# EasyEDA Pro project PT32S038x-Demo.eprj, board DEMOPT32x038x Development Kit 1.0
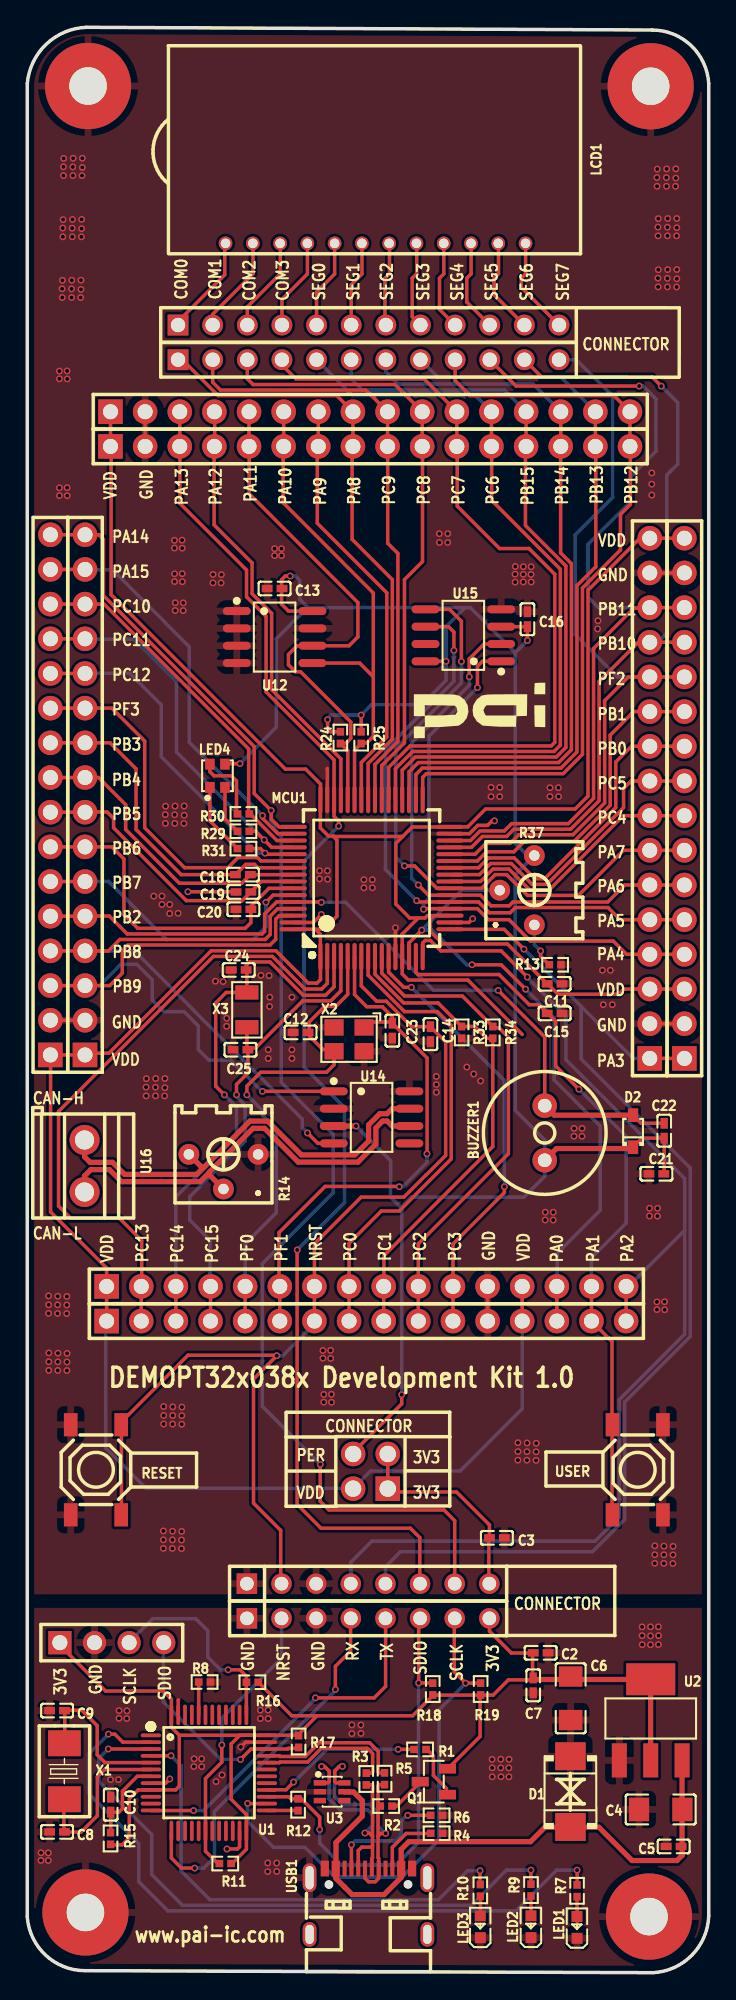
[diagram p3: board, top side]
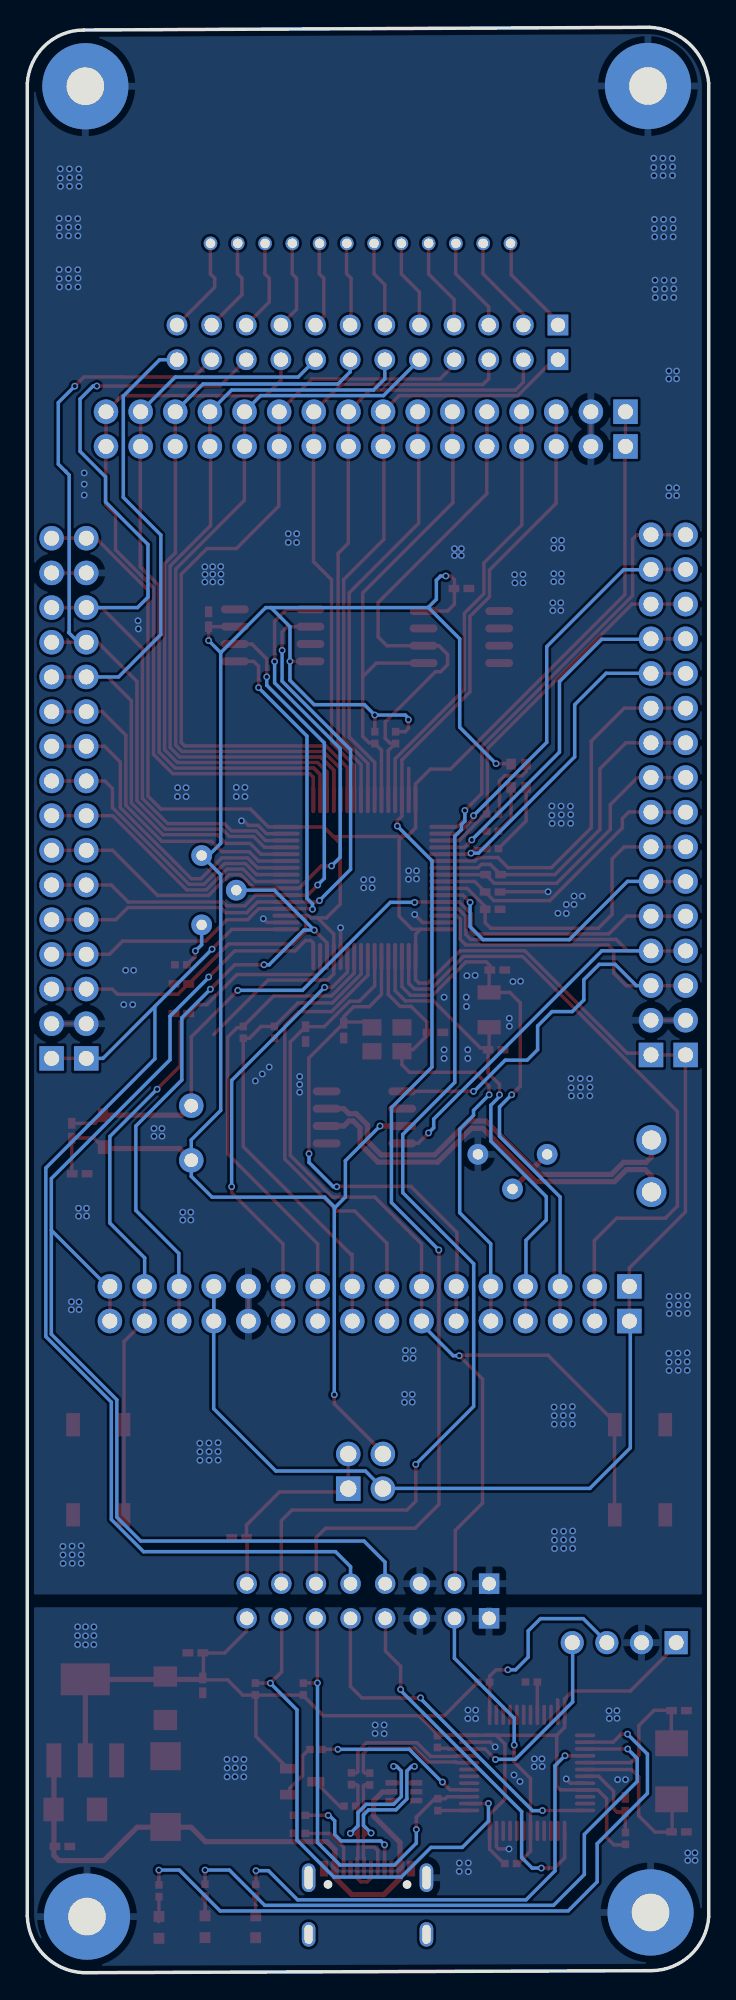
[diagram p4: board, bottom side, seen from below]

Outline 49.98 x 142.49 mm; copper layers: Top Layer, Bottom Layer. Coordinates in mm from the lower left corner of the outline.
Outline path: 0,138.38 0,4.09 arc(1.34,1.29) 4.23,0.15 45.89,0 arc(48.74,1.28) 49.98,4.16 49.98,138.36 arc(48.69,141.15) 45.83,142.29 4.36,142.49 arc(1.4,141.26) 0,138.38
Stack: Top Layer 0.035mm / Dielectric1 1.51mm FR4 er 4.5 / Bottom Layer 0.035mm

## Design rules (mm)
net D-: USB1
net D+: USB1
net USB_DM: USB2
net USB_DP: USB2
net CAN_H: CAN
net CAN_L: CAN
spacing safeClearance (default): track to track 0.152, other pairs 0.152 to 0.3
track width trackWidth (default): min 0.127, default 0.254, max 2.54
differential pair differentialPair (default): width min 0.127, default 0.254, max 2.54; gap min 0.152, default 0.152
via viaSize (default): diameter min 0.5, default 0.61, max 10; hole min 0.3, default 0.305, max 6

## Placement (name value [footprint] x y rotation side)
BUZZER1  2700Hz  [BUZ-TH_BD9.0-P4.00-D0.6-FD]  37.95 61.51 90 top
C2  100nF  [C0402]  37.65 23.43 180 top
C3  100nF  [C0402]  34.44 31.85 180 top
C4  10uF  [C1206]  46.46 11.96 0 top
C5  100nF  [C0402]  47.41 9.25 0 top
C6  10uF  [C1206]  39.85 20.1 90 top
C7  100nF  [C0402]  37.11 21.05 90 top
C8  20pF  [C0402]  2.18 10.31 0 top
C9  20pF  [C0402]  2.18 19.2 0 top
C10  100nF  [C0402]  6.12 12.31 270 top
C11  100nF  [C0402]  38.68 72.43 180 top
C12  12pF  [C0402]  20.04 68.87 180 top
C13  100nF  [C0402]  18.14 101.38 180 top
C14  100nF  [C0402]  29.57 68.74 90 top
C15  100nF  [C0402]  38.68 70.26 180 top
C16  10uF  [C0402]  36.68 99.13 90 top
C18  100nF  [C0402]  15.82 80.43 180 top
C19  100nF  [C0402]  15.85 79.16 180 top
C20  100nF  [C0402]  15.85 77.89 180 top
C21  100nF  [C0402]  46.14 58.52 0 top
C22  100nF  [C0402]  46.71 61.67 270 top
C23  12pF  [C0402]  26.77 69 90 top
C24  12pF  [C0402]  15.51 73.44 180 top
C25  12pF  [C0402]  15.64 67.6 180 top
CN4  RE-H042TD-1190(LF)(SN)  [HDR-TH_4P-P2.54-V_RE-H042TD-1190]  6.2 24.17 0 top
D1  P6SMB6.8CA/TR13  [SMB_L4.6-W3.6-LS5.3-BI]  39.83 13.26 270 top
D2  1N4148WS  [SOD-323_L1.8-W1.3-LS2.5-RD]  44.43 61.63 90 top
H1  KH-2.54PH180-1X12P-L11.5  [HDR-TH_12P-P2.54-V-M]  25.03 118.14 0 top
H2  KH-2.54PH180-1X16P-L11.5  [HDR-TH_16P-P2.54-V-M]  48.19 86.02 90 top
H3  A2541WV-2x2P  [HDR-TH_4P-P2.54-V-R2-C2-S2.54_A2541WV-2X2P]  25.17 36.72 90 top
H4  KH-2.54PH180-1X12P-L11.5  [HDR-TH_12P-P2.54-V-M]  25.03 120.68 0 top
H5  KH-2.54PH180-1X16P-L11.5  [HDR-TH_16P-P2.54-V-M]  45.65 86.02 90 top
H6  KH-2.54PH180-1X16P-L11.5  [HDR-TH_16P-P2.54-V-M]  25.15 111.79 0 top
H7  KH-2.54PH180-1X16P-L11.5  [HDR-TH_16P-P2.54-V-M]  25.15 114.33 0 top
H8  KH-2.54PH180-1X8P-L11.5  [HDR-TH_8P-P2.54-V-M]  25 25.95 0 top
H9  KH-2.54PH180-1X8P-L11.5  [HDR-TH_8P-P2.54-V-M]  25 28.49 0 top
H10  KH-2.54PH180-1X16P-L11.5  [HDR-TH_16P-P2.54-V-M]  24.87 47.73 0 top
H11  KH-2.54PH180-1X16P-L11.5  [HDR-TH_16P-P2.54-V-M]  24.87 50.27 0 top
H12  KH-2.54PH180-1X16P-L11.5  [HDR-TH_16P-P2.54-V-M]  4.24 86.27 90 top
H13  KH-2.54PH180-1X16P-L11.5  [HDR-TH_16P-P2.54-V-M]  1.7 86.27 90 top
LCD1  -  [LCD_12pin_4com_8seg]  25.34 133.39 0 top
LED1  19-217/GHC-YR1S2/3T  [LED0603-RD]  40.32 3.32 90 top
LED2  19-213/Y2C-CQ2R2L/3T(CY)  [LED0603-RD]  36.94 3.37 90 top
LED3  19-217/BHC-ZL1M2RY/3T  [LED0603-RD]  33.23 3.36 90 top
LED4  FM-B2020RGBA-HG  [LED-SMD_FM-B2020RGBA-HG]  13.95 87.67 90 top
MCU1  -  [LQFP-64_L10.0-W10.0-P0.50-LS12.0-BL]  25.25 80.17 0 top
NOREF  -  [DEMO板安装孔]  4.27 4.41 180 top
NOREF#2  -  [DEMO板安装孔]  45.6 4.11 180 top
NOREF#3  -  [DEMO板安装孔]  45.72 138.17 180 top
NOREF#4  -  [DEMO板安装孔]  4.46 138.19 180 top
Q1  SS8550 Y2  [SOT-23-3_L2.9-W1.3-P1.90-LS2.4-BR]  29.82 13.99 0 top
R1  1.5kΩ  [R0402]  28.81 16.35 180 top
R2  1.5kΩ  [R0402]  26.32 12.2 0 top
R3  22Ω  [R0402]  24.86 14.19 90 top
R4  5.1kΩ  [R0402]  30.02 10.21 0 top
R5  22Ω  [R0402]  26.2 14.21 90 top
R6  5.1kΩ  [R0402]  30.02 11.53 180 top
R7  1kΩ  [R0402]  40.32 6 90 top
R8  10kΩ  [R0402]  13 21.29 0 top
R9  1kΩ  [R0402]  36.94 6.05 90 top
R10  1kΩ  [R0402]  33.23 6.03 90 top
R11  10kΩ  [R0402]  14.52 8 180 top
R12  100Ω  [R0402]  19.86 12.3 90 top
R13  10kΩ  [R0402]  38.71 73.82 180 top
R14  1kΩ  [RES-ADJ-TH_3362P]  14.39 58.67 180 top
R15  10kΩ  [R0402]  6.11 9.83 270 top
R16  10kΩ  [R0402]  16.51 21.27 180 top
R17  10kΩ  [R0402]  19.9 16.93 270 top
R18  10kΩ  [R0402]  29.74 20.78 90 top
R19  10kΩ  [R0402]  33.25 20.78 90 top
R24  10kΩ  [R0402]  22.96 90.46 90 top
R25  10kΩ  [R0402]  24.49 90.46 90 top
R29  1kΩ  [R0402]  15.85 83.6 180 top
R30  1kΩ  [R0402]  15.85 84.87 180 top
R31  1kΩ  [R0402]  15.85 82.33 180 top
R33  100kΩ  [R0402]  31.85 68.87 90 top
R34  100kΩ  [R0402]  34.14 68.87 90 top
R37  10kΩ  [RES-ADJ-TH_3362P]  35.92 79.29 90 top
RESET  TS-1187A-B-A-B  [SW-SMD_4P-L5.1-W5.1-P3.70-LS6.5-TL-2]  5.04 36.84 270 top
U1  STM32F103CBT6  [LQFP-48_L7.0-W7.0-P0.50-LS9.0-BL]  13.32 14.63 270 top
U2  AMS1117-3.3  [SOT-223-3_L6.5-W3.4-P2.30-LS7.0-BR]  45.72 18.52 270 top
U3  NUP4202W1T2G  [SOT-363_L2.0-W1.3-P0.65-LS2.1-BR]  22.36 13.26 180 top
U12  K24C02  [SOIC-8_L4.9-W3.9-P1.27-LS6.0-BL]  18.14 97.83 270 top
U14  SN65HVD230DR  [SOIC-8_L4.9-W3.9-P1.27-LS6.0-BL]  25.25 62.65 270 top
U15  ZD25WD40BTIGT  [SOIC-8_L4.9-W3.9-P1.27-LS6.0-BL]  31.98 97.95 90 top
U16  KF128L-3.81-2P  [CONN-TH_P3.81_KF128L-3.81-2P]  4.2 59.09 270 top
USB1  TYPEC-304-ACP16  [USB-C-SMD_TYPE-C-16P-1]  25.02 5.22 0 top
USER  TS-1187A-B-A-B  [SW-SMD_4P-L5.1-W5.1-P3.70-LS6.5-TL-2]  44.77 36.84 90 top
X1  8MHz  [CRYSTAL-SMD_L5.0-W3.2]  2.73 14.75 270 top
X2  25MHz  [OSC-SMD_4P-L3.2-W2.5-BL]  23.6 68.36 180 top
X3  32KHz  [OSC-SMD_L3.2-W1.5]  16.11 70.52 270 top

## Footprints (pads in the part's own frame, mm; a bottom-side part is the same pattern mirrored in y, then rotated)
BUZ-TH_BD9.0-P4.00-D0.6-FD
  round 1.8 hole 1: 1(-2,0) 2(2,0)
C0402
  rect 0.79x0.54 smd: 1(-0.545,0) 2(0.545,0)
C1206
  rect 1.485x1.728 smd: 1(-1.593,0) 2(1.593,0)
CONN-TH_P3.81_KF128L-3.81-2P
  round 2.2 hole 1.4: 1(-1.905,0) 2(1.905,0)
CRYSTAL-SMD_L5.0-W3.2
  rect 1.9x2.4 smd: 1(-2.05,0) 2(2.05,0)
DEMO板安装孔
  round 6.32 hole 2.75: 1(0,0)
HDR-TH_4P-P2.54-V-R2-C2-S2.54_A2541WV-2X2P
  rect 1.8x1.8 hole 1.2: 1(-1.27,-1.27)
  round 1.8 hole 1.2: 2(-1.27,1.27) 3(1.27,-1.27) 4(1.27,1.27)
HDR-TH_4P-P2.54-V_RE-H042TD-1190
  rect 1.7x1.7 hole 1.1: 1(-3.81,0)
  round 1.7 hole 1.1: 2(-1.27,0) 3(1.27,0) 4(3.81,0)
HDR-TH_8P-P2.54-V-M
  rect 1.5x1.5 hole 1: 1(-8.89,0)
  round 1.5 hole 1: 2(-6.35,0) 3(-3.81,0) 4(-1.27,0) 5(1.27,0) 6(3.81,0) 7(6.35,0) 8(8.89,0)
HDR-TH_12P-P2.54-V-M
  rect 1.524x1.524 hole 1.05: 1(-13.97,0)
  round 1.524 hole 1.05: 2(-11.43,0) 3(-8.89,0) 4(-6.35,0) 5(-3.81,0) 6(-1.27,0) 7(1.27,0) 8(3.81,0) 9(6.35,0) 10(8.89,0) 11(11.43,0) 12(13.97,0)
HDR-TH_16P-P2.54-V-M
  rect 1.8x1.8 hole 1.1: 1(-19.05,0)
  round 1.8 hole 1.1: 2(-16.51,0) 3(-13.97,0) 4(-11.43,0) 5(-8.89,0) 6(-6.35,0) 7(-3.81,0) 8(-1.27,0) 9(1.27,0) 10(3.81,0) 11(6.35,0) 12(8.89,0) 13(11.43,0) 14(13.97,0) 15(16.51,0) 16(19.05,0)
LCD_12pin_4com_8seg
  round 1 hole 0.7: 1(-10.795,-6.731) 2(-8.795,-6.731) 3(-6.795,-6.731) 4(-4.795,-6.731) 5(-2.795,-6.731) 6(-0.795,-6.731) 7(1.205,-6.731) 8(3.205,-6.731) 9(5.205,-6.731) 10(7.205,-6.731) 11(9.205,-6.731) 12(11.205,-6.731)
LED0603-RD
  rect 0.8x0.8 smd: 1(-0.799,-0.004) 2(0.799,0.004)
LED-SMD_FM-B2020RGBA-HG
  rect 0.8x0.701 smd: 1(-0.851,0.551) 2(0.851,0.551) 3(0.851,-0.551) 4(-0.851,-0.551)
LQFP-48_L7.0-W7.0-P0.50-LS9.0-BL
  oval 0.27x1.5 smd: 1(-2.75,-4.25) 2(-2.25,-4.25) 3(-1.75,-4.25) 4(-1.25,-4.25) 5(-0.75,-4.25) 6(-0.25,-4.25) 7(0.25,-4.25) 8(0.75,-4.25) 9(1.25,-4.25) 10(1.75,-4.25) 11(2.25,-4.25) 12(2.75,-4.25) 25(2.75,4.25) 26(2.25,4.25) 27(1.75,4.25) 28(1.25,4.25) 29(0.75,4.25) 30(0.25,4.25) 31(-0.25,4.25) 32(-0.75,4.25) 33(-1.25,4.25) 34(-1.75,4.25) 35(-2.25,4.25) 36(-2.75,4.25)
  oval 1.5x0.27 smd: 13(4.25,-2.75) 14(4.25,-2.25) 15(4.25,-1.75) 16(4.25,-1.25) 17(4.25,-0.75) 18(4.25,-0.25) 19(4.25,0.25) 20(4.25,0.75) 21(4.25,1.25) 22(4.25,1.75) 23(4.25,2.25) 24(4.25,2.75) 37(-4.25,2.75) 38(-4.25,2.25) 39(-4.25,1.75) 40(-4.25,1.25) 41(-4.25,0.75) 42(-4.25,0.25) 43(-4.25,-0.25) 44(-4.25,-0.75) 45(-4.25,-1.25) 46(-4.25,-1.75) 47(-4.25,-2.25) 48(-4.25,-2.75)
LQFP-64_L10.0-W10.0-P0.50-LS12.0-BL
  oval 0.3x2 smd: 1(-3.75,-5.75) 2(-3.25,-5.75) 3(-2.75,-5.75) 4(-2.25,-5.75) 5(-1.75,-5.75) 6(-1.25,-5.75) 7(-0.75,-5.75) 8(-0.25,-5.75) 9(0.25,-5.75) 10(0.75,-5.75) 11(1.25,-5.75) 12(1.75,-5.75) 13(2.25,-5.75) 14(2.75,-5.75) 15(3.25,-5.75) 16(3.75,-5.75) 33(3.75,5.75) 34(3.25,5.75) 35(2.75,5.75) 36(2.25,5.75) 37(1.75,5.75) 38(1.25,5.75) 39(0.75,5.75) 40(0.25,5.75) 41(-0.25,5.75) 42(-0.75,5.75) 43(-1.25,5.75) 44(-1.75,5.75) 45(-2.25,5.75) 46(-2.75,5.75) 47(-3.25,5.75) 48(-3.75,5.75)
  oval 2x0.3 smd: 17(5.75,-3.75) 18(5.75,-3.25) 19(5.75,-2.75) 20(5.75,-2.25) 21(5.75,-1.75) 22(5.75,-1.25) 23(5.75,-0.75) 24(5.75,-0.25) 25(5.75,0.25) 26(5.75,0.75) 27(5.75,1.25) 28(5.75,1.75) 29(5.75,2.25) 30(5.75,2.75) 31(5.75,3.25) 32(5.75,3.75) 49(-5.75,3.75) 50(-5.75,3.25) 51(-5.75,2.75) 52(-5.75,2.25) 53(-5.75,1.75) 54(-5.75,1.25) 55(-5.75,0.75) 56(-5.75,0.25) 57(-5.75,-0.25) 58(-5.75,-0.75) 59(-5.75,-1.25) 60(-5.75,-1.75) 61(-5.75,-2.25) 62(-5.75,-2.75) 63(-5.75,-3.25) 64(-5.75,-3.75)
OSC-SMD_4P-L3.2-W2.5-BL
  rect 1.4x1.2 smd: 1(-1.1,-0.875) 2(1.1,-0.875) 3(1.1,0.875) 4(-1.1,0.875)
OSC-SMD_L3.2-W1.5
  rect 1.05x1.7 smd: 1(-1.275,0) 2(1.275,0)
R0402
  rect 0.566x0.54 smd: 1(-0.433,0) 2(0.433,0)
RES-ADJ-TH_3362P
  round 1.524 hole 0.762: 1(-2.54,-1.27) 2(0,1.27) 3(2.54,-1.27)
SMB_L4.6-W3.6-LS5.3-BI
  rect 2.047x2.241 smd: 1(-2.591,0) 2(2.591,0)
SOD-323_L1.8-W1.3-LS2.5-RD
  rect 1x0.75 smd: 1(-1.173,0) 2(1.173,0)
SOIC-8_L4.9-W3.9-P1.27-LS6.0-BL
  oval 0.588x2.045 smd: 1(-1.905,-2.772) 2(-0.635,-2.772) 3(0.635,-2.772) 4(1.905,-2.772) 5(1.905,2.772) 6(0.635,2.772) 7(-0.635,2.772) 8(-1.905,2.772)
SOT-23-3_L2.9-W1.3-P1.90-LS2.4-BR
  rect 1.25x0.7 smd: 1(1,-0.95) 2(1,0.95) 3(-1,0)
SOT-223-3_L6.5-W3.4-P2.30-LS7.0-BR
  rect 2.5x1.1 smd: 1(2.97,-2.3) 2(2.97,0) 3(2.97,2.3)
  rect 2.34x3.6 smd: 4(-2.97,0)
SOT-363_L2.0-W1.3-P0.65-LS2.1-BR
  rect 0.9x0.4 smd: 1(0.9,-0.65) 2(0.9,0) 3(0.9,0.65) 4(-0.9,0.65) 5(-0.9,0) 6(-0.9,-0.65)
SW-SMD_4P-L5.1-W5.1-P3.70-LS6.5-TL-2
  rect 1.7x1 smd: 1(-3.3,1.85) 2(3.3,1.85) 3(-3.3,-1.85) 4(3.3,-1.85)
USB-C-SMD_TYPE-C-16P-1
  rect 0.6x1.15 smd: A1B12(-3.2,2.41) A4B9(-2.4,2.41) B1A12(3.2,2.41) B4A9(2.4,2.41)
  rect 0.3x1.15 smd: A5(-1.25,2.41) A6(-0.25,2.41) A7(0.25,2.41) A8(1.25,2.41) B5(1.75,2.41) B6(0.75,2.41) B7(-0.75,2.41) B8(-1.75,2.41)
  oval 1x2.1 hole 0.6x1.7: EP(-4.32,1.74) EP(4.32,1.74)
  oval 1x1.8 hole 0.6x1.4: EP(-4.32,-2.41) EP(4.32,-2.41)

## Nets
As in the schematic, except:
GND: C2.1 C3.1 C4.1 C5.1 C6.1 C7.1 C8.1 C9.1 C10.1 C11.1 C12.2 C13.2 C14.1 C15.1 C16.2 C19.2 C20.2 C21.1 C23.1 C24.2 C25.2 CN4.2 D1.1 H2.2 H2.15 H5.2 H5.15 H6.2 H7.2 H8.1 H8.3 H9.1 H9.3 H10.12 H11.12 H12.2 H13.2 LED1.1 LED2.1 LED3.1 MCU1.12 MCU1.18 MCU1.31 MCU1.47 MCU1.63 NOREF.1 NOREF#2.1 NOREF#3.1 NOREF#4.1 R4.2 R6.1 R8.2 R13.1 R14.1 R33.1 RESET.3 RESET.4 U1.8 U1.23 U1.35 U1.47 U2.1 U3.2 U12.1 U12.2 U12.3 U12.4 U12.7 U14.2 U14.8 U15.4 USB1.A1B12 USB1.B1A12 USB1.EP USER.3 USER.4 X2.2 X2.4
DEMO_NRST: C14.2 H9.2 H10.7 H11.7 MCU1.7 RESET.1 RESET.2
PA1/USER_KEY: C15.2 H10.15 H11.15 MCU1.15 USER.1 USER.2

Pads without a net: U1 1 10 11 14 15 16 17 19 20 21 22 29 30 31 38 39 40 41 42 43 45 46; U3 3 4; U14 5; U15 7; USB1 A8 B8

## Via types
v1: diameter 0.5, hole 0.3, Top Layer to Bottom Layer, 365 vias

## Routing (per net, layer and track width the routed paths; a pad name or vN(x,y) marks a point on that pad's centre or on a via; arc(x,y) is an arc through that point)
GND: length 35.2
  Top Layer w0.254: v1(21.57,77.51) 20.98,76.92 MCU1.63 ; H2.2 H5.2 ; v1(32.67,77.2) 32.4,76.92 MCU1.18 ; H6.2 H7.2 ; 11.07,18.87 11.07,19.96 11.1,19.98 ; H2.15 H5.15 ; U1.23 15.57,9.22 15.41,9.06 v1(14.65,9.06) ; v1(11.78,79.17) 15.29,79.17 C19.2 ; 22,85.92 22,88.2 22,88.2 ; 9.06,13.88 10.15,13.88 v1(10.45,14.19) ; 17.58,16.89 17.57,16.89 16.02,16.89 v1(15.66,16.53) ; H10.12 H11.12 ; MCU1.31 32.43,83.42 33.04,84.04 33.76,84.04 34.09,84.37 v1(34.27,84.37) ; H12.2 H13.2 ; v1(27,76.54) MCU1.12
  vias: v1(1.01,8.78) v1(1,8.22) v1(1.56,49.57) v1(1.57,48.92) v1(1.56,48.29) v1(1.54,8.77) v1(1.54,8.22) v1(1.58,45.4) v1(1.58,44.75) v1(1.58,44.12) v1(2.23,49.55) v1(2.23,48.92) v1(2.22,48.29) v1(2.25,45.38) v1(2.24,44.74) v1(2.24,44.11) v1(2.36,117.31) v1(2.36,116.74) v1(2.36,108.76) v1(2.36,108.19) v1(2.55,123.34) v1(2.56,122.7) v1(2.67,132.89) v1(2.65,132.27) v1(2.66,131.63) v1(2.62,128.4) v1(2.6,127.79) v1(2.61,127.14) v1(2.58,123.96) v1(2.92,117.32) v1(2.93,116.73) v1(2.92,108.77) v1(2.93,108.18) v1(2.9,49.53) v1(2.9,48.91) v1(2.89,48.28) v1(2.92,45.36) v1(2.91,44.73) v1(2.91,44.1) v1(3.27,123.97) v1(3.24,123.33) v1(3.25,122.7) v1(3.36,132.9) v1(3.34,132.26) v1(3.35,131.63) v1(3.31,128.41) v1(3.29,127.78) v1(3.3,127.14) v1(3.97,127.14) v1(3.94,123.97) v1(3.94,123.29) v1(3.92,122.69) v1(4.03,132.9) v1(4.03,132.22) v1(4.01,131.62) v1(3.99,128.42) v1(3.99,127.74) v1(6.11,14.14) v1(6.73,19.19) v1(6.73,18.63) v1(6.68,14.14) v1(7.31,19.18) v1(7.3,18.62) v1(8.73,65.48) v1(8.71,64.86) v1(8.72,64.22) v1(9.28,78.85) v1(9.42,65.49) v1(9.4,64.85) v1(9.41,64.22) v1(9.88,78.86) v1(9.88,78.24) v1(10,41.47) v1(10,40.82) v1(10,40.19) v1(9.98,32.35) v1(9.98,31.7) v1(9.98,31.08) v1(10.15,85.44) v1(10.12,84.82) v1(10.13,84.18) v1(10.09,65.49) v1(10.09,64.82) v1(10.07,64.22) v1(10.45,78.24) v1(10.44,77.58) v1(10.67,41.45) v1(10.66,40.81) v1(10.66,40.18) v1(10.65,32.34) v1(10.64,31.7) v1(10.64,31.07) v1(10.79,104.91) v1(10.79,104.35) v1(10.8,102.46) v1(10.8,101.89) v1(10.85,100.34) v1(10.85,99.77) v1(10.83,85.45) v1(10.81,84.81) v1(10.82,84.18) v1(11.06,77.6) v1(11.36,104.92) v1(11.36,104.34) v1(11.36,102.47) v1(11.37,101.88) v1(11.34,41.43) v1(11.34,40.8) v1(11.33,40.17) v1(11.32,32.32) v1(11.31,31.69) v1(11.31,31.06) v1(11.44,100.33) v1(11.43,99.77) v1(11.51,85.45) v1(11.51,84.78) v1(11.49,84.18) v1(12.23,15.66) v1(12.22,15.1) v1(12.79,15.66) v1(12.8,15.09) v1(13.62,102.42) v1(13.62,101.79) v1(13.8,72.62) v1(13.84,14) v1(14.24,102.4) v1(14.22,101.79) v1(14.36,72.59) v1(14.28,14.48) v1(14.63,69.91) v1(14.62,69.32) v1(17.13,73.05) v1(17.09,19.23) v1(17.1,18.61) v1(17.67,67.6) v1(17.67,66.96) v1(17.66,19.24) v1(17.67,18.61) v1(17.63,8.04) v1(17.63,7.4) v1(17.74,73.02) v1(17.77,70.77) v1(17.78,71.45) v1(18.14,104.3) v1(18.14,103.8) v1(18.29,8.03) v1(18.3,7.42) v1(18.65,104.3) v1(18.65,103.8) v1(19.41,71.45) v1(19.41,67.6) v1(19.41,66.97) v1(21.43,80.71) v1(21.43,80.11) v1(21.68,45.57) v1(21.68,45) v1(21.75,42.36) v1(21.75,41.79) v1(22.01,80.71) v1(22.03,80.09) v1(22.24,45.58) v1(22.25,44.99) v1(22.31,42.37) v1(22.32,41.78) v1(23.81,18.15) v1(23.81,17.51) v1(24.47,18.14) v1(24.47,17.53) v1(24.69,80.06) v1(24.69,79.46) v1(25.31,80.06) v1(25.31,79.46) v1(30,65.64) v1(30,65.05) v1(30,64.49) v1(30.22,105.4) v1(30.23,104.75) v1(30.84,105.4) v1(30.84,104.76) v1(32.24,66.33) v1(32.74,65.82) v1(33.25,65.32) v1(34.02,86.82) v1(34.01,86.14) v1(34.09,15.62) v1(34.1,15) v1(34.1,14.34) v1(34.65,86.81) v1(34.65,86.14) v1(34.72,15.64) v1(34.73,15) v1(34.74,14.35) v1(35.33,15.63) v1(35.32,15) v1(35.32,14.34) v1(35.77,102.44) v1(35.79,103) v1(35.78,101.85) v1(35.98,38.82) v1(35.99,38.17) v1(35.98,37.54) v1(36.38,102.98) v1(36.38,102.43) v1(36.37,101.86) v1(36.66,38.8) v1(36.65,38.16) v1(36.64,37.53) v1(36.95,102.97) v1(36.94,102.42) v1(36.95,101.86) v1(37.33,38.78) v1(37.32,38.15) v1(37.31,37.52) v1(37.99,55.7) v1(37.98,55.13) v1(38.34,86.79) v1(38.33,86.14) v1(38.57,55.13) v1(38.57,55.7) v1(38.95,86.79) v1(38.97,86.14) v1(40.1,61.84) v1(40.1,61.27) v1(40.69,61.84) v1(40.68,61.26) v1(41.86,99.02) v1(41.83,98.42) v1(42.18,73.42) v1(42.24,70.9) v1(42.76,73.42) v1(42.9,70.9) v1(45.09,25.33) v1(45.09,24.69) v1(45.09,24.03) v1(45.64,55.99) v1(45.63,55.42) v1(45.71,25.33) v1(45.71,24.67) v1(45.7,24.02) v1(45.8,109.85) v1(45.8,109.03) v1(45.8,108.23) v1(46.02,31.27) v1(46.03,30.61) v1(46.02,29.99) v1(46.2,132.11) v1(46.18,131.49) v1(46.19,130.85) v1(46.25,127.86) v1(46.26,127.22) v1(46.25,124.11) v1(46.26,123.47) v1(46.22,55.99) v1(46.22,55.42) v1(46.18,49.13) v1(46.18,48.57) v1(46.28,128.48) v1(46.28,124.73) v1(46.29,25.34) v1(46.3,24.69) v1(46.29,24.03) v1(46.74,49.14) v1(46.75,48.56) v1(46.69,31.25) v1(46.69,30.61) v1(46.68,29.98) v1(46.87,131.48) v1(46.89,132.12) v1(46.88,130.85) v1(46.97,128.48) v1(46.94,127.85) v1(46.95,127.22) v1(46.97,124.74) v1(46.94,124.1) v1(46.95,123.47) v1(47.36,31.23) v1(47.36,30.6) v1(47.35,29.97) v1(47.56,132.12) v1(47.56,131.44) v1(47.54,130.84) v1(47.64,128.49) v1(47.64,127.81) v1(47.62,127.21) v1(47.64,124.74) v1(47.64,124.07) v1(47.62,123.47)
VDD: length 241.2
  Top Layer w0.254: MCU1.64 21.13,76.42 ; 21.13,76.42 21.49,76.06 21.49,75.01 ; 21.13,76.42 21.75,76.42 22.71,77.38 22.71,82.97 22.47,83.21 22.48,83.22 ; 22.48,83.22 22.46,83.24 22.1,83.24 21.5,83.84 21.5,85.87 ; 22.48,83.22 27.54,83.22 ; 28.68,77.25 27.5,76.07 MCU1.13 27.5,73.15 27.95,72.7 32.32,72.7 36.3,68.72 ; 28.68,77.25 28.04,77.25 27.03,78.27 27.03,82.71 27.54,83.22 ; 28.68,77.25 29.17,77.25 29.34,77.42 29.82,77.42 ; H2.16 45.78,105.07 ; 45.78,105.07 H5.16 ; 45.78,105.07 45.79,105.08 ; 45.78,105.07 45.75,105.09 44.96,105.09 41.12,101.26 41.12,86.18 40.18,85.23 33.61,85.23 32.3,83.92 MCU1.32 30.99,83.92 28.23,83.92 27.54,83.22 ; 5.82,50.23 5.82,50.22 ; 5.82,50.23 5.82,51.61 1.71,55.72 1.71,67 ; 5.82,50.23 H10.1 ; 21.5,74.58 21.5,72.74 21.25,72.48 20.6,72.48 18.23,74.85 13.48,74.85 5.98,67.35 4.26,67.35 ; 45.62,72.07 45.59,72.05 43.74,72.05 43.36,71.67 38.92,71.67 38.16,72.43 C11.2 35.21,75.35 30.48,75.35 29.57,76.26 29.57,77.17 29.82,77.42 ; 21.51,85.99 21.51,87.06 20.42,88.15 18.93,88.15 6.15,100.94 6.15,111.76 ; 29.82,77.42 MCU1.19 ; H10.13 H11.13 ; H6.1 H7.1 ; H13.1 H12.1 ; H2.3 H5.3
  Bottom Layer w0.254: 23.69,35.47 8.72,35.47 5.75,38.44 5.75,47.57 5.85,47.67 ; 36.27,47.67 36.31,47.63 36.31,41.31 31.74,36.75 25.18,36.75 23.92,35.49 23.88,35.49 ; 36.3,49.49 H10.13
CAN_H: length 31.7
  Top Layer w0.381: U14.7 26.76,63.28 26.39,62.92 25.85,62.92 25.03,62.1 25.03,60.91 24.03,59.9 20.1,59.9 17.62,62.38 16.33,62.38 12.99,59.03 12.76,59.03 R14.3 ; 12.87,58.92 12.41,58.47 7.13,58.47 6.25,59.35 4.61,59.35 4.2,59.76 U16.1
CAN_L: length 31.8
  Top Layer w0.381: R14.2 13.35,58.44 13.35,58.64 16.55,61.84 17.4,61.84 19.88,59.37 24.25,59.37 25.57,60.69 25.57,61.88 26.07,62.38 26.39,62.38 26.76,62.01 U14.6 ; 13.24,58.5 12.68,57.94 6.91,57.94 6.03,58.82 4.66,58.82 4.2,58.36 U16.2
CMSIS_NRST: length 6.3
  Top Layer w0.254: 9.07,14.39 8.07,14.39 6.98,13.3 6.98,12.02 6.72,11.75 6.11,11.75 ; 6.12,10.27 6.12,11.75
COM0: length 7.4
  Top Layer w0.254: H4.1 11.06,120.94 14.49,124.36 14.49,126.64
COM1: length 7.2
  Top Layer w0.254: 16.55,126.64 16.55,124.43 13.6,121.48 H4.2
COM2: length 7
  Top Layer w0.254: 18.56,126.65 18.56,124.44 16.14,122.02 H4.3
COM3: length 6.7
  Top Layer w0.254: 20.55,126.62 20.55,124.42 18.68,122.56 H4.4
D+: length 20.1
  Top Layer w0.254: R5.1 25.82,13.77 25.73,13.69 25.73,9.99 ; USB1.A6 24.77,6.92 25.03,6.66 25.52,6.66 25.77,6.92 USB1.B6 25.77,8.38 25.73,8.43 25.73,9.99 ; 25.73,9.99 25.94,10.2 v1(26.28,10.2) ; U3.6 22.64,13.91 22.55,14 22.55,14.78 22.88,15.12 v1(23.11,15.12)
  Bottom Layer w0.254: v1(26.28,10.2) 25.73,10.76 25.73,11.72 25.12,12.33 23.11,12.33 22.55,12.9 22.55,14.77 22.89,15.12 v1(23.11,15.12)
D-: length 19.9
  Top Layer w0.254: U3.1 22.05,13.91 22.14,14 22.14,14.76 21.8,15.11 v1(21.58,15.11) ; 25.32,9.99 25.08,10.23 v1(24.76,10.23) ; 25.32,9.99 25.32,9.31 ; 25.32,9.99 25.32,13.67 25.23,13.76 24.87,13.76 R3.1 ; USB1.B7 24.27,8.94 24.53,9.2 25.21,9.2 25.32,9.31 ; 25.32,9.31 25.32,8.43 25.27,8.38 USB1.A7
  Bottom Layer w0.254: v1(21.58,15.11) 21.8,15.11 22.14,14.77 22.14,12.73 22.94,11.93 24.95,11.93 25.32,11.55 25.32,10.79 v1(24.76,10.23)
DAP_3V3: length 96.8
  Top Layer w0.254: 16.42,17.39 17.61,17.4 ; 16.42,17.39 15.59,17.39 ; 16.42,17.39 15.59,17.39 ; 17.61,17.4 17.57,17.4 ; 17.61,17.4 19.87,17.4 19.9,17.37 ; 33.21,20.33 29.77,20.33 ; 33.21,20.33 33.21,20.39 ; 33.21,20.33 33.21,17.31 30.84,14.93 ; 33.21,20.33 34.16,20.33 35.28,21.45 36.98,21.45 37.06,21.52 ; 29.77,20.33 28.26,18.82 21.25,18.82 ; 29.77,20.33 29.79,20.34 ; 29.77,20.33 29.67,20.33 ; 15.59,17.39 14.95,16.75 14.95,12.7 16.07,11.58 16.07,9.04 14.97,7.94 ; 15.59,17.39 11.15,17.39 ; 11.15,17.39 11.15,13.66 10.88,13.39 9.08,13.39 ; 11.15,17.39 10.57,17.97 10.57,20.04 ; 19.86,17.43 21.25,18.82 ; 21.25,18.82 19.4,18.82 16.93,21.29 ; 33.9,25.94 33.9,25.02 35.5,23.42 37.1,23.42 37.11,23.42 ; 37.06,23.4 37.06,21.61 ; 9.08,13.39 8.13,13.39 7.49,12.74 7.49,9.89 6.96,9.36 6.13,9.36 ; 9.08,13.39 9.04,13.39 ; 10.57,20.04 9.98,20.63 5.75,20.63 2.3,24.07
  Top Layer w0.381: 45.46,21.48 37.29,21.48 37.11,21.66 ; 45.77,15.81 45.72,15.86 45.72,21.46
DAP_5V: length 45.2
  Top Layer w0.381: 39.14,10.65 41.92,10.65 44.36,8.21 47.65,8.21 48.03,8.59 48.03,9.31 ; 39.14,10.65 37.96,10.65 36.91,9.6 27.99,9.6 27.42,9.03 27.42,6.97 26.17,5.72 23.82,5.72 23.26,6.28 ; 39.14,10.65 39.15,10.64 ; 48.02,15.43 48.02,9.32 48,9.31 ; 23.26,6.28 23.26,6.28 ; 23.26,6.28 22.64,6.9 22.64,9.54 24.57,11.47 24.57,12.59 23.93,13.23 23.31,13.23
DAP_NRST: length 20.8
  Top Layer w0.254: v1(14.27,16.68) 14.27,15.42 13.07,14.23 13.07,8.9 14.06,7.9
  Bottom Layer w0.254: 18.65,25.94 18.65,23.03 14.27,18.65 v1(14.27,16.68)
DAP_SWCLK: length 38.1
  Top Layer w0.254: 31.32,25.96 31.32,22.04 v1(32.15,21.21) 33.2,21.21 33.24,21.25 ; 16.13,12.38 17.57,12.38
  Bottom Layer w0.254: v1(32.15,21.21) 30.2,19.25 30.2,9.71 27.49,7 22.54,7 20.37,9.18 18.08,9.18 16.15,11.1 v1(16.15,12.4)
DAP_SWDIO: length 33
  Top Layer w0.254: 19.84,12.74 19.88,12.74 ; 19.84,12.74 19.33,12.74 19.18,12.88 17.53,12.88 ; 19.84,12.74 20.08,12.75 21.44,11.39 v1(21.44,10.49) ; 29.11,26.24 28.71,25.83 28.71,21.23 v1(28.7,21.22) 29.7,21.22 29.71,21.21
  Bottom Layer w0.254: v1(28.7,21.22) 28.69,21.21 28.69,9.53 27.04,7.88 23.05,7.88 21.44,9.48 v1(21.44,10.49)
DAP_UART_RX: length 27.2
  Top Layer w0.254: v1(22.6,20.74) 22.6,22.44 23.71,23.55 23.71,25.88 23.74,25.91 ; v1(12.28,7.66) 11.31,7.66 10.57,8.4 10.57,10.24
  Bottom Layer w0.254: v1(22.6,20.74) 22.6,20.68 13.72,11.8 13.72,8.44 12.95,7.66 v1(12.28,7.66)
DAP_UART_TX: length 26
  Top Layer w0.254: v1(21.13,20.13) 25.44,20.13 26.28,20.97 26.28,25.94 ; 12.19,11.88 9.08,11.88
  Bottom Layer w0.254: v1(12.2,11.88) 12.2,11.87 12.92,11.87 21.13,20.08 v1(21.13,20.13)
DEBUG_OSC_IN: length 11.3
  Top Layer w0.254: 2.72,19.08 2.75,19.05 2.75,16.78 ; 9.07,15.39 5.7,15.39 5.13,15.96 5.13,18.09 4,19.22 2.88,19.22
DEBUG_OSC_OUT: length 12.2
  Top Layer w0.254: 9.09,14.88 9.08,14.88 5.67,14.88 5.14,14.35 5.14,11.5 3.94,10.3 2.86,10.3 ; 2.65,12.74 2.68,12.71 2.68,10.37
DEBUG_SWCLK: length 14.9
  Top Layer w0.254: v1(14.73,22.18) 15.6,22.18 16.07,21.71 16.07,21.29 ; 16.07,18.9 16.07,21.23
  Bottom Layer w0.254: 7.48,24.21 9.2,25.93 12.34,25.93 13.24,25.04 13.24,23.11 14.17,22.18 v1(14.73,22.18)
DEBUG_SWDIO: length 16.5
  Top Layer w0.254: v1(15.64,15.62) 16.41,16.39 ; 16.41,16.38 19.1,16.38 19.15,16.43 19.88,16.43 19.91,16.46
  Bottom Layer w0.254: 9.98,24.26 9.98,19.83 14.18,15.63 15.63,15.63 15.64,15.64
DEMO_3V3: length 15.4
  Top Layer w0.254: 33.9,31.92 33.9,32.79 31.48,35.21 26.56,35.21 26.36,35.41 ; H3.3 H3.1 ; 33.85,28.52 33.85,31.82 33.92,31.89
DEMO_NRST: length 78.6
  Top Layer w0.254: H10.7 H11.7 ; MCU1.7 24.5,72.27 25.62,71.16 26.33,71.16 28.19,69.29 C14.2 30.69,68.17 30.69,59.86 29.27,58.44 29.25,58.44 27.62,56.81 24.49,56.81 21.06,53.38 21.06,50.27 ; v1(18.3,45.19) 16.59,43.48 16.59,34.39 18.59,32.4 18.59,28.48 ; 18.26,45.23 11.79,45.23 6.77,40.21 ; 6.93,39.94 6.91,39.92 6.91,33.48
  Bottom Layer w0.254: v1(18.3,45.19) 18.74,45.19 21.06,47.51 21.06,47.62 ; 21.06,47.78 21.06,47.62 ; 21.06,47.62 21.08,47.63
LED_ALARM: length 45.1
  Top Layer w0.254: v1(36.94,7.52) 36.94,6.5 36.95,6.49 ; v1(5.94,16.39) 9.08,16.39
  Bottom Layer w0.254: v1(36.94,7.52) 35.15,7.52 32.56,4.93 11.38,4.93 9.12,7.19 9.12,10.13 5.24,14.01 5.24,15.69 v1(5.94,16.39)
LED_DEBUG/UART: length 35
  Top Layer w0.254: 9.08,15.89 10.53,15.89 v1(10.54,15.89) ; 33.22,6.43 33.2,6.44 v1(33.2,7.47)
  Bottom Layer w0.254: v1(10.54,15.89) 11.28,15.16 11.28,7.46 13.4,5.34 30.16,5.34 32.29,7.47 v1(33.2,7.47)
LED_USB: length 51.7
  Top Layer w0.254: 9.07,16.89 7.04,16.89 7.02,16.87 6.42,17.47 v1(5.95,17.47) ; v1(40.32,7.51) 40.32,6.4
  Bottom Layer w0.254: v1(40.32,7.51) 38.82,7.51 35.83,4.53 10.31,4.53 8.18,6.66 8.18,9.45 4.5,13.13 4.5,16.02 v1(5.95,17.47)
PA0/ADC_IN0: length 46.5
  Top Layer w0.254: v1(28.93,76.36) 28,75.43 MCU1.14 ; v1(32.62,73.82) 34.76,73.82 v1(36.55,72.03) ; H10.14 H11.14
  Bottom Layer w0.254: v1(36.55,72.03) 38.64,69.94 38.64,65.39 42.01,62.01 42.01,55.83 38.86,52.68 38.86,50.31 ; v1(32.62,73.82) 32.23,73.82 29.69,76.36 v1(28.93,76.36) 31.85,79.29 R37.2
PA1/USER_KEY: length 52.8
  Top Layer w0.254: v1(40.46,64.71) 38.75,66.42 38.75,69.67 37.52,70.9 36.81,70.9 34.6,73.11 28.67,73.11 28.5,73.28 MCU1.15 ; 42.89,33.41 42.89,40.14 42.92,40.18 ; H11.15 H10.15 42.88,46.22 42.88,40.35
  Bottom Layer w0.254: v1(40.46,64.71) 43.92,61.25 43.92,54.91 41.37,52.36 41.37,50.29
PA2/DEMO_UART0_TX: length 87.3
  Top Layer w0.254: v1(36.67,72.93) 34.76,74.84 30.33,74.84 29.57,75.6 29.19,75.6 29,75.42 MCU1.16 ; H11.16 H10.16
  Bottom Layer w0.254: 48.21,54.38 48.21,58.17 39.51,66.87 39.51,70.06 36.67,72.89 v1(36.67,72.93) ; 48.21,54.38 48.21,46.77 43.41,41.96 43.41,33.37 41.66,31.61 25.28,31.61 23.74,30.07 23.74,28.44 ; 48.21,54.38 44,50.17
PA3/DEMO_UART0_RX: length 83.3
  Top Layer w0.254: H2.1 H5.1 ; v1(36.43,74.97) 34.97,76.42 31,76.42 MCU1.17
  Bottom Layer w0.254: 44.81,66.97 44.43,66.97 40.62,70.78 ; 26.27,28.53 26.27,29.74 27.37,30.84 41.45,30.84 43.81,33.2 43.81,41.79 48.62,46.6 48.62,58.94 40.62,66.94 40.62,70.78 ; 40.62,70.78 v1(36.43,74.97)
PA4/SPI0_CS: length 41.9
  Top Layer w0.254: v1(29.06,77.89) 29.11,77.93 33.01,77.93 33.82,77.13 35.33,77.13 36.9,75.56 42.98,75.56 43.96,74.59 45.65,74.59 45.67,74.57 ; v1(33.02,94.12) 33.02,95.69 33.38,96.05 U15.1 ; H2.4 H5.4
  Bottom Layer w0.254: v1(33.02,94.12) 29.46,90.57 29.46,78.69 29.05,78.28 29.06,78.27 v1(29.06,77.89)
PA5/SPI0_SCK: length 45.5
  Top Layer w0.254: v1(31.29,96.85) 31.29,98.19 30.89,98.59 U15.6 ; v1(28.55,78.52) 28.65,78.42 MCU1.21 33.1,78.42 33.89,77.63 35.41,77.63 35.79,78.02 42.59,78.02 43.48,77.13 H5.5 H2.5
  Bottom Layer w0.254: v1(28.55,78.52) 26.27,80.81 26.27,89.57 31.29,94.6 v1(31.29,96.85)
PA6/SPI0_MISO: length 42.1
  Top Layer w0.254: v1(28.68,79.67) 29.43,78.92 30.99,78.92 MCU1.22 31,78.93 33.23,78.93 34.01,78.14 35.34,78.14 35.62,78.42 42.57,78.42 43.82,79.67 45.64,79.67 45.65,79.68 ; 34.75,97.32 33.51,97.32 32.41,96.23 v1(32.41,94.91) ; H2.6 H5.6
  Bottom Layer w0.254: v1(28.68,79.67) 28.19,80.15 28.19,90.08 32.41,94.3 v1(32.41,94.91)
PA7/SPI0_MOSI: length 46.8
  Top Layer w0.254: H2.7 H5.7 ; v1(27.66,81.06) 28.4,81.06 30.04,79.42 MCU1.23 33.31,79.42 34.32,80.43 35.16,80.43 36.68,78.9 40.42,78.9 43.72,82.21 45.65,82.21 45.66,82.19 ; v1(31.84,96.04) 31.84,98.99 30.97,99.86 U15.5
  Bottom Layer w0.254: v1(31.84,96.04) 31.84,94.47 27.03,89.66 27.03,81.7 v1(27.66,81.06)
PA8/LCD0: length 44.7
  Top Layer w0.254: 23.93,111.69 23.82,111.59 23.82,104.98 26.77,102.03 26.77,90.35 25,88.57 MCU1.41 ; H6.8 H7.8 22.7,115.51 14,115.51 11.37,118.14 H1.1
PA9: length 31.3
  Top Layer w0.254: 21.3,111.76 21.27,111.73 21.27,106.16 26.37,101.07 26.37,90.51 24.5,88.65 MCU1.42 ; H6.7 H7.7
PA10/I2C1_SDA: length 36.7
  Top Layer w0.254: H6.6 H7.6 ; 25.38,94.92 25.38,90.56 24.9,90.08 24.54,90.08 24,89.54 MCU1.43 ; 25.38,94.92 25.38,101.06 18.76,107.67 18.76,111.55 18.87,111.65 ; 25.38,94.92 24.38,95.92 U12.5
PA11/I2C1_SCL: length 38.9
  Top Layer w0.254: 20.92,97.19 19.79,97.19 19.15,96.56 19.15,95.8 19.66,95.29 20.04,95.29 23.73,91.6 23.73,90.41 23.37,90.05 22.96,90.05 23.5,89.51 23.5,85.93 MCU1.44 ; 20.92,97.19 20.93,97.21 ; 20.92,97.19 23.6,97.19 24.25,97.84 24.25,100.35 16.28,108.32 16.28,111.63 16.24,111.67 ; H6.5 H7.5
PA12/CMP3_N: length 32.1
  Top Layer w0.254: 13.74,111.77 13.74,114.2 13.76,114.22 ; MCU1.45 23,88.9 17.92,93.98 17.92,99.57 16.49,101 16.49,103.26 13.7,106.04 13.7,111.75
PA13/DEMO_SWDIO: length 101.8
  Top Layer w0.254: 11.18,111.66 11.19,111.67 ; H6.3 H7.3 ; 11.19,111.69 11.19,107.62 16.08,102.73 16.08,100.77 17.51,99.34 17.51,93.81 22.5,88.83 MCU1.46 22.5,84.7 22.84,84.37 v1(22.84,83.98) ; 28.79,28.56 28.79,31.87 28.1,32.56 21.54,32.56 19.79,34.3 19.79,52.93 v1(19.8,52.94)
  Bottom Layer w0.254: v1(19.8,52.94) 23.27,56.41 23.27,63.36 20.3,66.33 20.3,81.44 v1(22.84,83.98)
PA14/DEMO_SWCLK: length 102.8
  Top Layer w0.254: v1(21.48,37.23) 21.48,34.53 22.13,33.89 30.57,33.89 31.35,33.11 31.35,28.54 ; 5.24,105.32 4.33,105.32 ; H12.16 H13.16 ; MCU1.49 18.46,83.92 17.88,84.5 v1(17.88,85.13) 16.64,86.37 16.64,89.81 5.59,100.86 5.59,104.98 5.26,105.31 5.26,105.33
  Bottom Layer w0.254: v1(17.88,85.13) 17.88,84.34 18.14,84.09 18.14,83.73 18.62,83.24 18.62,65.21 22.44,61.4 22.44,57.13 17.24,51.93 17.24,41.48 v1(21.48,37.23)
PA15: length 29.9
  Top Layer w0.254: MCU1.50 18.38,83.42 17.25,84.56 v1(17.25,84.75) ; H12.15 H13.15
  Bottom Layer w0.254: 4.33,102.76 6.25,102.76 11.88,97.12 11.88,90.12 v1(17.25,84.75)
PB0: length 24.1
  Top Layer w0.254: 45.66,89.83 45.67,89.83 ; 45.66,89.83 H2.10 ; 45.66,89.83 H5.10 44.31,89.83 43.16,88.68 43.16,85.34 37.94,80.12 37.24,80.12 35.72,81.65 33.81,81.65 33.09,80.92 MCU1.26
PB1: length 24.7
  Top Layer w0.254: H2.11 H5.11 ; 45.61,92.37 44.48,92.37 42.75,90.64 42.75,85.51 40.11,82.87 36.45,82.87 35.69,82.1 33.7,82.1 33.02,81.42 MCU1.27
PB2/BEEP: length 56.9
  Top Layer w0.254: 4.32,77.38 1.79,77.38 ; 4.32,77.38 4.32,77.38 6.02,77.39 7.33,76.09 17.22,76.09 17.41,76.27 17.41,77.55 18.29,78.42 MCU1.60 19.5,78.43 21.54,78.43 v1(21.57,78.4) ; 4.32,77.38 4.33,77.38 ; BUZZER1.2 37.95,68.54 v1(34.54,71.95) ; C22.1 45.02,62.21 D2.2
  Top Layer w0.381: D2.2 38.65,62.81 BUZZER1.2
  Bottom Layer w0.254: v1(34.54,71.95) 29.8,71.95 23.35,78.4 v1(21.57,78.4)
PB3/LCD35: length 24.8
  Top Layer w0.254: 4.31,90.08 6.07,90.08 7.98,88.18 7.98,83.73 11.28,80.43 C18.2 16.02,81.18 16.67,81.18 16.92,80.92 MCU1.55 ; 4.31,90.08 1.79,90.08 ; 4.31,90.08 4.25,90.02
PB4/LCD34: length 22.3
  Top Layer w0.254: H12.9 H13.9 ; 5.23,87.54 4.33,87.54 ; 5.23,87.54 7.22,85.55 7.22,83.73 11.15,79.79 15.73,79.79 C18.1 16.36,80.42 MCU1.56
PB5/LCD33: length 21.3
  Top Layer w0.254: 4.43,85.02 5.85,85.02 6.33,84.54 6.33,83.85 11.66,78.52 15.76,78.52 C19.1 17.16,79.92 MCU1.57 ; H12.8 H13.8
PB6/LCD32: length 24.5
  Top Layer w0.254: 4.28,82.52 4.34,82.46 6.2,82.46 7.09,81.57 7.09,77.51 8.11,76.49 15.98,76.49 16.4,76.91 C20.1 16.4,78.1 17.72,79.42 MCU1.58 ; H12.7 H13.7
PB7: length 22
  Top Layer w0.254: v1(17.5,78.4) 18.03,78.92 MCU1.59 ; H12.6 H13.6
  Bottom Layer w0.254: 4.2,79.97 4.24,79.93 5.95,79.93 10.22,75.66 16.55,75.66 17.5,76.62 v1(17.5,78.4)
PB8/CAN_RX: length 44.1
  Top Layer w0.254: U14.4 21.31,60.74 v1(20.55,61.51) ; H12.4 H13.4 ; MCU1.61 18.36,77.92 17.81,77.38 17.81,76.04 17.45,75.68 6.79,75.68 5.94,74.83 4.38,74.83
  Bottom Layer w0.254: v1(20.55,61.51) 20.17,61.89 20.17,62.52 7.85,74.84 4.33,74.84 4.32,74.84
PB9/CAN_TX: length 45.3
  Top Layer w0.254: v1(17.25,64.55) U14.1 ; MCU1.62 18.48,77.42 18.22,77.17 18.22,75.69 17.81,75.27 7.38,75.27 6.97,74.86 6.97,73.22 6.06,72.3 4.33,72.3 ; H12.3 H13.3
  Bottom Layer w0.254: v1(17.25,64.55) 17.21,64.55 14.92,66.84 13.31,66.84 12.55,67.6 12.55,69.34 11.49,70.4 10.01,70.4 9.16,71.25 9.16,72.73 8.03,73.86 6.87,73.86 5.31,72.3 5.18,72.3
PB10/LCD10: length 59
  Top Layer w0.254: 44.81,97.45 41.94,94.58 41.94,85.84 39.85,83.76 35.69,83.76 35.16,83.22 33.38,83.22 32.58,82.42 MCU1.29 ; H1.11 37.73,116.87 42.93,116.87 42.94,116.88 45.82,116.88 v1(46.5,116.21) ; H2.13 H5.13
  Bottom Layer w0.254: 45.69,97.46 46.25,97.46 46.94,98.16 46.9,98.2 46.9,109.7 47.16,109.95 ; 47.16,109.95 47.7,110.49 47.7,115 v1(46.5,116.21) ; 47.16,109.95 47.16,109.97
PB11/LCD9: length 65.5
  Top Layer w0.254: MCU1.30 32.51,82.92 33.21,83.63 34.99,83.63 35.52,84.16 39.68,84.16 41.53,86.01 41.53,96.99 44.48,99.93 45.62,99.93 45.67,99.99 ; H1.10 35.85,116.21 v1(44.88,116.21) ; 45.67,99.99 H2.14 ; 45.67,99.99 H5.14
  Bottom Layer w0.254: 45.67,99.97 45.66,99.99 41.89,99.99 41.12,100.75 41.12,104.61 44.24,107.72 44.24,109.56 46.11,111.43 46.11,115.26 45.16,116.21 v1(44.88,116.21)
PB12/LCD8: length 55.7
  Top Layer w0.254: H1.9 31.38,116.62 32.48,115.51 43.02,115.51 H7.16 H6.16 ; 44.23,111.64 44.23,107.54 43.51,106.81 43.51,104.21 40.72,101.42 40.72,89.24 39.31,87.82 29.27,87.82 29,87.56 MCU1.33
PB13/LCD7: length 54.4
  Top Layer w0.254: MCU1.34 28.5,87.76 28.97,88.23 39.14,88.23 40.31,89.41 40.31,101.59 41.69,102.97 41.69,111.78 ; H6.15 H7.15 ; 41.68,111.46 41.54,111.6
  Bottom Layer w0.254: H7.15 39.12,116.87 30.11,116.87 H1.8
PB14/LCD6: length 54.6
  Top Layer w0.254: H6.14 H7.14 ; 39.06,111.72 39.11,111.67 39.11,103.99 39.91,103.2 39.91,89.57 38.97,88.64 28.68,88.64 28,87.96 MCU1.35
  Bottom Layer w0.254: H1.7 26.3,117.25 27.19,116.36 37.09,116.36 H7.14
PB15/LCD5: length 55.7
  Top Layer w0.254: MCU1.36 27.5,85.93 27.5,88.08 28.46,89.04 38.8,89.04 39.5,89.74 39.5,103.03 36.54,106 36.54,111.56 36.59,111.62 ; H6.13 H7.13
  Bottom Layer w0.254: H1.6 23.76,116.74 24.58,115.92 35,115.92 H7.13
PC0/OPA3_P: length 34.5
  Top Layer w0.254: MCU1.8 25,73.06 27.66,70.4 30.08,70.4 31.09,69.38 31.09,59.6 27.28,55.79 25.97,55.79 23.59,53.42 ; 23.6,53.42 H11.8 H10.8
PC1/OPA3_N: length 35.9
  Top Layer w0.254: H10.9 H11.9 ; MCU1.9 25.5,73.13 27.6,71.03 30.13,71.03 R33.2 32.83,69.3 33.69,68.44 R34.1 34.14,60.51 26.26,52.62 26.16,52.62 26.16,50.28
PC2/OPA3_OUT: length 35.9
  Top Layer w0.254: 28.68,50.33 28.68,53.38 35.28,59.98 35.28,68.52 34.59,69.21 34.23,69.21 R34.2 31.91,71.54 27.67,71.54 26,73.21 MCU1.10 ; H10.10 H11.10
PC3: length 32
  Top Layer w0.254: 31.22,50.53 31.22,53.37 34.99,57.14 v1(34.99,57.57) ; 31.22,50.4 H11.11 H10.11 ; MCU1.11 26.5,73.28 27.61,72.17 v1(28.17,72.17)
  Bottom Layer w0.254: v1(28.17,72.17) 34.99,65.35 v1(34.99,57.57)
PC4/CMP3_P0: length 20.4
  Top Layer w0.254: 45.64,84.75 45.64,84.75 43.72,84.75 38.28,79.31 36.85,79.31 35.32,80.83 34.15,80.83 33.24,79.92 MCU1.24 ; H5.8 H2.8
PC5: length 22
  Top Layer w0.254: 44.28,87.29 H5.9 H2.9 ; 44.28,87.28 43.73,86.73 43.73,85.34 38.11,79.72 37.02,79.72 35.49,81.24 33.98,81.24 33.17,80.43 31.14,80.43
PC6/LCD4: length 55.9
  Top Layer w0.254: MCU1.37 27,88.18 28.27,89.45 38.63,89.45 39.09,89.91 39.09,102.8 34.06,107.84 34.06,111.68 34.03,111.71 ; H6.12 H7.12
  Bottom Layer w0.254: H7.12 32.86,115.51 23.85,115.51 H1.5
PC7/LCD3: length 58.7
  Top Layer w0.254: 31.5,111.81 H6.11 31.5,111.78 ; 31.5,111.81 H7.11 29.11,116.73 19.71,116.73 18.68,117.76 H1.4 ; 31.5,111.81 31.46,111.85 ; 31.5,111.81 31.51,111.81 ; 31.61,111.66 31.5,111.78 ; 31.61,111.66 31.53,111.59 31.53,107.42 34.64,104.31 36.8,104.31 38.69,102.42 38.69,90.11 38.43,89.86 28.08,89.86 26.5,88.28 MCU1.38 ; 31.61,111.66 31.61,111.71 31.51,111.81 ; 31.5,111.78 31.51,111.81
PC8/LCD2: length 44.8
  Top Layer w0.254: H6.10 H7.10 26.97,116.32 16.56,116.32 16.14,116.74 H1.3 ; 28.99,111.68 28.99,103.36 27.66,102.03 27.66,90.08 26,88.42 26,85.93 MCU1.39 ; 29,111.69 29.03,111.72
PC9/LCD1: length 44.7
  Top Layer w0.254: H6.9 H7.9 24.84,115.92 14.17,115.92 13.6,116.49 H1.2 ; MCU1.40 25.5,88.5 27.18,90.18 27.18,103.95 26.43,104.7 26.43,111.69
PC10/LED_B: length 27.7
  Top Layer w0.254: 4.31,100.28 4.35,100.24 5.63,100.24 16.23,89.64 16.23,84.92 R30.1 16.36,84.87 18.31,82.92 MCU1.51 ; H12.14 H13.14
PC11/LED_G: length 28.5
  Top Layer w0.254: R29.1 16.74,83.6 v1(17.38,82.97) 17.92,82.42 MCU1.52 ; H12.13 H13.13
  Bottom Layer w0.254: 4.3,97.71 4.35,97.67 7.85,97.67 10.95,94.57 10.95,89.4 v1(17.38,82.97)
PC12/LED_R: length 26.7
  Top Layer w0.254: H12.12 H13.12 ; R31.1 17.1,82.33 v1(17.44,82) 17.51,81.92 MCU1.53
  Bottom Layer w0.254: v1(17.44,82) 16.89,82 9.83,89.05 9.83,92.87 7.53,95.17 4.33,95.17
PC13: length 47.5
  Top Layer w0.254: MCU1.2 22,72.46 21.59,72.05 20.36,72.05 17.97,74.44 13.65,74.44 2.29,63.09 2.29,56.15 3.18,55.26 6.75,55.26 8.39,53.63 8.39,50.3 ; H10.2 H11.2
PC14/OSC32_IN: length 40.3
  Top Layer w0.254: v1(14.46,64.3) 13.82,64.93 13.82,71.03 14.59,71.8 X3.1 16.11,73.39 C24.1 16.05,73.78 16.31,74.03 17.81,74.03 20.25,71.59 21.87,71.59 22.5,72.22 MCU1.3 ; H10.3 H11.3
  Bottom Layer w0.254: 10.87,50.34 10.9,50.38 10.9,56.82 15.34,61.27 15.34,63.41 v1(14.46,64.3)
PC15/OSC32_OUT: length 35.6
  Top Layer w0.254: 16.11,69.25 16.11,67.68 C25.1 ; H10.4 H11.4 ; C25.1 16.31,67.73 16.74,67.73 20.2,71.18 22.26,71.18 23,71.92 23,74.42 MCU1.4 ; C25.1 16.18,65.9 15.34,65.06 v1(15.34,64.3)
  Bottom Layer w0.254: 13.46,50.26 13.4,50.32 13.4,53.64 11.92,55.13 11.92,56.84 15.98,60.9 15.98,63.54 15.34,64.17 v1(15.34,64.3)
PER_3V3: length 156.6
  Top Layer w0.254: 14.5,88.52 14.54,88.56 v1(15.6,88.56) ; v1(30.71,96.05) U15.8 ; U15.3 C16.1 v1(36.68,97.57) ; v1(19.28,102.3) 18.93,102.3 18.65,102.02 18.65,101.42 C13.1 18.65,101.35 18.65,100.24 19.15,99.73 U12.8 ; v1(27.46,42.34) 27.46,41.66 23.89,38.09 ; v1(24.49,92.11) R25.2 ; v1(22.02,91.78) 22.02,91.13 22.26,90.89 R24.2 ; 46.71,58.41 C22.2 45.09,61.12 D2.1
  Top Layer w0.381: BUZZER1.1 38.81,60.36 44.33,60.36 D2.1 ; v1(24.11,62.01) U14.3
  Bottom Layer w0.254: 20.55,99.99 32.11,99.99 ; 20.55,99.99 18.27,97.7 18.27,91.22 v1(15.6,88.56) ; 20.55,99.99 20.55,100.02 19.98,100.6 19.98,101.99 19.67,102.3 v1(19.28,102.3) ; 32.11,99.99 30.71,98.59 v1(30.71,96.05) 30.71,94.65 28.93,92.87 25.25,92.87 v1(24.49,92.11) 22.25,92.11 22.02,91.89 v1(22.02,91.78) ; 32.11,99.99 32.49,99.99 35.79,96.68 ; v1(36.68,97.57) 35.79,96.68 ; 35.79,96.68 35.79,82.71 36.68,81.83 R37.3 35.79,80.43 35.79,63.16 37.95,61 BUZZER1.1 37.95,58.33 36.43,56.81 28.17,56.81 27.41,56.04 ; v1(24.11,62.01) 26.65,59.47 26.65,56.81 27.41,56.04 ; 27.41,56.04 27.46,55.99 27.46,42.28
PF0/OSC_IN: length 36.9
  Top Layer w0.254: v1(16.11,64.3) 16.11,64.93 17.12,65.95 21.95,65.95 22.5,66.5 22.5,67.62 21.68,67.62 20.68,68.62 20.68,69.63 21.82,70.78 22.62,70.78 23.5,71.65 MCU1.5 ; H10.5 H11.5
  Bottom Layer w0.254: 15.99,50.24 15.99,53.39 18.27,55.66 18.27,61.78 17.25,62.8 17.25,63.16 v1(16.11,64.3)
PF1/OSC_OUT: length 39.5
  Top Layer w0.254: C23.2 26.77,70.01 26.04,70.75 24.9,70.75 24,71.65 24,74.42 MCU1.6 ; C23.2 29.32,66.99 29.32,59.99 v1(29.31,59.98) ; C23.2 26.68,69.63 24.97,69.63 24.7,69.37 ; H10.6 H11.6 ; v1(27.28,57.57) 27.26,57.59 21.84,57.59 18.46,54.21 18.46,50.44
  Bottom Layer w0.254: v1(29.31,59.98) 29.31,59.35 27.54,57.57 v1(27.28,57.57)
PF2/LCD11: length 56.5
  Top Layer w0.254: H2.12 H5.12 44.08,94.91 ; 44.08,94.9 42.34,93.17 42.34,85.67 40.02,83.35 36.05,83.35 35.41,82.71 33.63,82.71 32.84,81.92 MCU1.28
  Bottom Layer w0.254: 44.81,94.91 43.28,94.91 40.19,98.01 40.19,105.31 42.93,108.05 42.93,115.47 40.27,118.14 H1.12
PF3/CMP3_OUT: length 26.7
  Top Layer w0.254: H12.11 H13.11 ; 19.48,81.43 17.14,81.43 16.89,81.68 15.46,81.68 14.72,80.94 11.53,80.94 8.61,83.86 8.61,90.21 6.2,92.62 4.34,92.62 4.32,92.6
SEG0: length 6.5
  Top Layer w0.254: H4.5 21.22,123.1 22.54,124.42 22.54,126.64
SEG1: length 6.3
  Top Layer w0.254: 24.55,126.65 24.55,124.43 23.76,123.64 H4.6
SEG2: length 6.1
  Top Layer w0.254: H4.7 26.23,120.75 26.23,124.11 26.56,124.44 26.56,126.65
SEG3: length 6.3
  Top Layer w0.254: 28.56,126.64 28.56,124.44 28.23,124.11 28.23,121.29 H4.8
SEG4: length 6.6
  Top Layer w0.254: H4.9 30.23,121.83 30.23,124.11 30.55,124.43 30.55,126.65
SEG5: length 6.8
  Top Layer w0.254: 32.55,126.64 32.55,124.43 32.23,124.11 32.23,122.37 H4.10
SEG6: length 7
  Top Layer w0.254: 34.56,126.67 34.56,124.44 34.23,124.11 34.23,122.91 H4.11
SEG7: length 7.3
  Top Layer w0.254: 36.55,126.66 36.55,124.42 36.23,124.11 36.23,123.45 H4.12
USB_DM: length 10.2
  Top Layer w0.254: R3.2 25.22,14.62 25.33,14.73 25.33,16.04 24.94,16.43 21.57,16.43 20.56,15.43 18.54,15.43 18.5,15.38 U1.32
USB_DP: length 10.8
  Top Layer w0.254: U1.33 18.5,15.88 18.54,15.84 20.4,15.84 21.4,16.84 25.11,16.84 25.74,16.21 25.74,14.73 25.83,14.64 R5.2
USB_ENUM: length 12
  Top Layer w0.254: 19.54,13.97 18.97,13.4 17.64,13.4 ; 28.35,16.35 28.34,16.36 v1(27.2,16.36)
  Bottom Layer w0.254: 27.25,16.36 21.96,16.36 19.56,13.96 v1(19.53,13.96)
$1N1624: length 4.6
  Top Layer w0.254: 29.56,10.2 27.79,10.2 26.77,9.18 26.77,7.74
$1N1626: length 9
  Top Layer w0.254: v1(23.77,9.37) 23.77,7.71 23.8,7.68 ; 29.63,11.54 29.62,11.52 v1(27.91,11.52)
  Bottom Layer w0.254: v1(23.77,9.37) 24.06,9.65 26.96,9.65 27.43,10.12 27.43,11.12 27.86,11.55 27.86,11.53
$1N1634: length 2.8
  Top Layer w0.254: 28.84,13.97 27.03,12.17 26.8,12.17
$1N1635: length 4
  Top Layer w0.254: 29.33,16.34 29.79,15.89 29.79,14.45 30.74,13.49 30.74,13 30.8,12.94
$1N3630: length 2.3
  Top Layer w0.254: 17.57,11.88 19.88,11.88
$1N3648: length 2.4
  Top Layer w0.254: 12.57,18.86 12.57,21.26
$1N50133: length 1.8
  Top Layer w0.254: 40.35,3.74 40.32,3.76 40.32,5.58
$1N50272: length 1.8
  Top Layer w0.254: 36.94,5.67 36.94,3.94 36.92,3.92
$1N50411: length 1.7
  Top Layer w0.254: 33.24,5.62 33.23,5.61 33.23,3.95
$2N17159: length 3.6
  Top Layer w0.254: 14.5,86.82 14.5,84.52 R29.2
$2N17293: length 5.2
  Top Layer w0.254: R30.2 15.34,84.95 15.34,87.29 14.96,87.67 13.69,87.67 13.4,87.96 LED4.2
$2N17427: length 5.3
  Top Layer w0.254: R31.2 13.4,84.36 LED4.1
$2N53882: length 3.4
  Top Layer w0.254: R13.2 37.65,74.46 v1(37.65,74.83)
  Bottom Layer w0.254: R37.1 37.19,75.29 v1(37.65,74.83)

## Copper pours and planes (outline as drawn; the poured copper is in the pictures)
GND on Top Layer: 0.01,142.48 49.98,142.48 49.98,0.1 0.01,0.1
GND on Bottom Layer: 0.01,142.49 49.98,142.49 49.98,0.12 0.01,0.12

## Text on the board
Top Silkscreen Layer: CAN-H | CAN-L | VDD | GND | PB4 | PF3 | PB3 | PB5 | PB6 | PA14 | PC12 | PA15 | PB7 | PC11 | PC10 | PB2 | PB8 | PB9 | PER | 3V3 | PA3 | PA4 | PA5 | PA6 | PA7 | PC4 | PB0 | PC5 | PF2 | PB1 | PB10 | PB11 | SCLK | PC13 | SDIO | PC14 | COM0 | PA13 | PC15 | COM1 | PA12 | PF0 | COM2 | PA11 | PF1 | COM3 | NRST | PA10 | SEG0 | PA9 | PC0 | RX | SEG1 | PA8 | PC1 | SEG2 | TX | PC9 | PC2 | SEG3 | PC8 | PC3 | SEG4 | PC7 | SEG5 | PC6 | SEG6 | PB15 | PA0 | PB14 | SEG7 | PA1 | PB13 | PA2 | PB12 | CONNECTOR | www.pai-ic.com | DEMOPT32x038x Development Kit 1.0
